# EAGLE schematic mic-preamp-stereo8x (EAGLE 6.2)
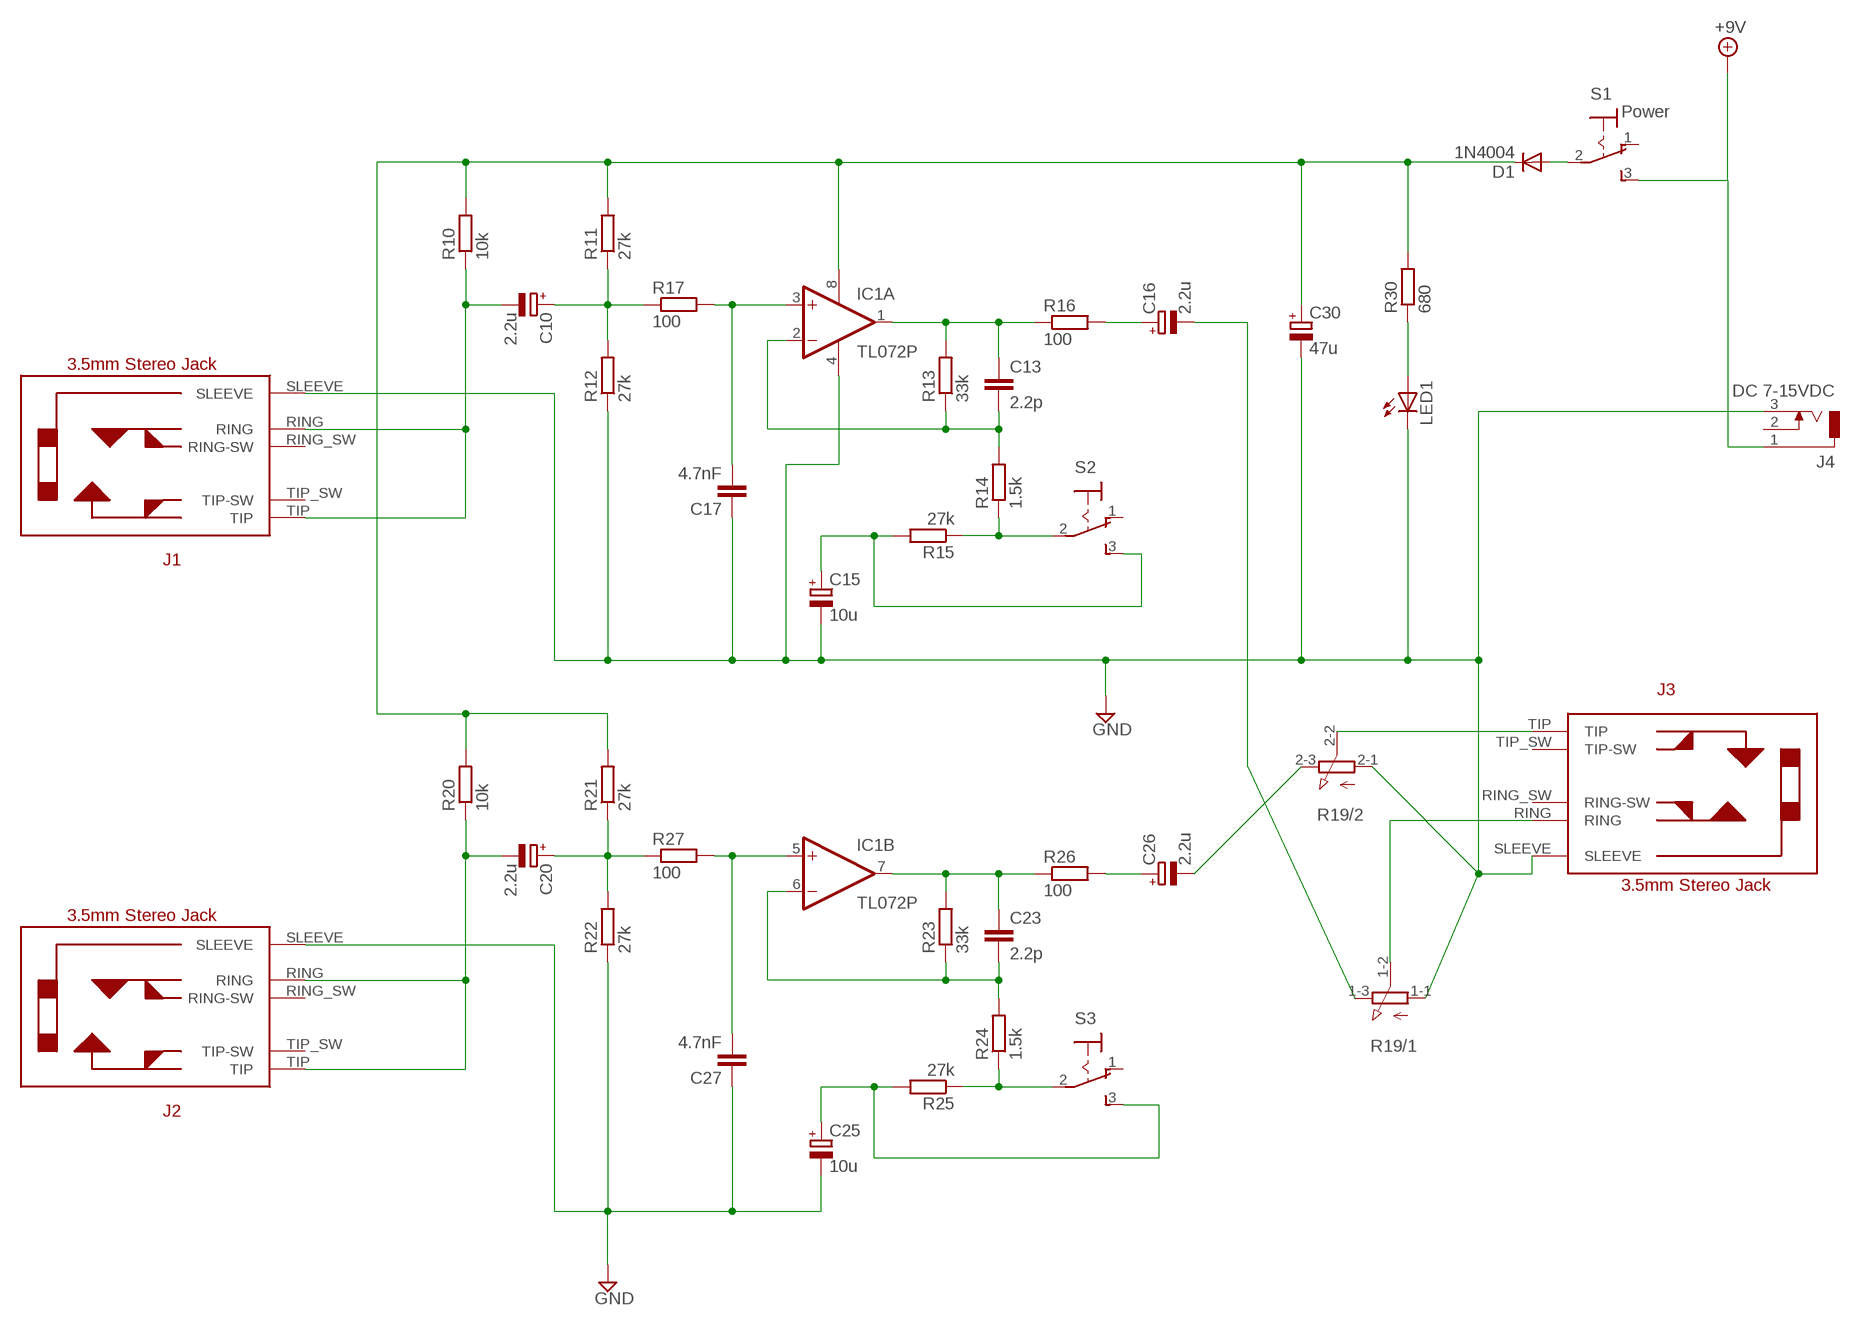
[diagram p0: schematic, sheet 1]

## Parts
C10  2.2u  CPOL-EUE2-5  [E2-5]
C13  2.2p  C-EU025-024X044  [C025-024X044]
C15  10u  CPOL-EUE2-5  [E2-5]
C16  2.2u  CPOL-EUE2-5  [E2-5]
C17  4.7nF  C-EU025-024X044  [C025-024X044]
C20  2.2u  CPOL-EUE2-5  [E2-5]
C23  2.2p  C-EU025-024X044  [C025-024X044]
C25  10u  CPOL-EUE2-5  [E2-5]
C26  2.2u  CPOL-EUE2-5  [E2-5]
C27  4.7nF  C-EU025-024X044  [C025-024X044]
C30  47u  CPOL-EUE2-5  [E2-5]
D1  1N4004  [DO41-10]
IC1  TL072P  [DIL08]
J1  PICAXE_STEREOJACKSOCKET  [PICAXE_STEREOJACKSOCKET]
J2  PICAXE_STEREOJACKSOCKET  [PICAXE_STEREOJACKSOCKET]
J3  Stereo Out  PICAXE_STEREOJACKSOCKET  [PICAXE_STEREOJACKSOCKET]
J4  DC 7-15VDC  DCJ0202  [DCJ0202]
LED1  LED5MM  [LED5MM]
R10  10k  R-EU_0207/5V  [0207/5V]
R11  27k  R-EU_0207/5V  [0207/5V]
R12  27k  R-EU_0207/5V  [0207/5V]
R13  33k  R-EU_0207/5V  [0207/5V]
R14  1.5k  R-EU_0207/5V  [0207/5V]
R15  27k  R-EU_0207/5V  [0207/5V]
R16  100  R-EU_0207/5V  [0207/5V]
R17  100  R-EU_0207/5V  [0207/5V]
R19  3RP/1610G  [3RP/1610G]
R20  10k  R-EU_0207/5V  [0207/5V]
R21  27k  R-EU_0207/5V  [0207/5V]
R22  27k  R-EU_0207/5V  [0207/5V]
R23  33k  R-EU_0207/5V  [0207/5V]
R24  1.5k  R-EU_0207/5V  [0207/5V]
R25  27k  R-EU_0207/5V  [0207/5V]
R26  100  R-EU_0207/5V  [0207/5V]
R27  100  R-EU_0207/5V  [0207/5V]
R30  680  R-EU_0207/5V  [0207/5V]
S1  Power  M9040P  [M9040P]
S2  M9040P  [M9040P]
S3  M9040P  [M9040P]

## Nets
+9V: J4.1 S1.3(S)
GND [Ground]: C15.- C17.1 C25.- C27.1 C30.- IC1.4(P:V-) J1.SLEEVE J2.SLEEVE J3.SLEEVE J4.3 LED1.K(C) R12.1 R19.1-1(/1:A) R19.2-1(/2:A) R22.1
N$1: C10.+ R11.1 R12.2 R17.1
N$2: C13.1 IC1.1(A:OUT) R13.2 R16.1
N$3: C13.2 IC1.2(A:-IN) R13.1 R14.2
N$4: C30.+ D1.C IC1.8(P:V+) R10.2 R11.2 R20.2 R21.2 R30.2
N$5: R14.1 R15.1 S2.2(P)
N$6: C16.+ R16.2
N$7: C10.- J1.RING J1.TIP R10.1
N$8: D1.A S1.2(P)
N$9: C15.+ R15.2 S2.3(S)
N$10: C16.- R19.1-3(/1:E)
N$11: LED1.A R30.1
N$12: C20.+ R21.1 R22.2 R27.1
N$13: C26.- R19.2-3(/2:E)
N$16: C23.1 IC1.7(B:OUT) R23.2 R26.1
N$17: C23.2 IC1.6(B:-IN) R23.1 R24.2
N$18: J3.TIP R19.2-2(/2:S)
N$19: R24.1 R25.1 S3.2(P)
N$20: C26.+ R26.2
N$21: C20.- J2.RING J2.TIP R20.1
N$22: C25.+ R25.2 S3.3(S)
N$23: J3.RING R19.1-2(/1:S)
N$24: C17.2 IC1.3(A:+IN) R17.2
N$27: C27.2 IC1.5(B:+IN) R27.2
Unconnected: J1.RING_SW(RING-SW) J1.TIP_SW(TIP-SW) J2.RING_SW(RING-SW) J2.TIP_SW(TIP-SW) J3.RING_SW(RING-SW) J3.TIP_SW(TIP-SW) J4.2 S1.1(O) S2.1(O) S3.1(O)

## Library data of the parts
C10 C15 C16 C20 C25 C26 C30 = rcl:CPOL-EU: POLARIZED CAPACITOR, European symbol
C13 C17 C23 C27 = rcl:C-EU: CAPACITOR, European symbol
D1 = diode:1N4004: DIODE general purpose rectifier, 1 A
IC1 = linear:TL072: OP AMP
J1-J3 = PICAXE_StereoJackSocket:PICAXE_STEREOJACKSOCKET
J4 = con-jack:DCJ0202: DC POWER JACK Source: DCJ0202.pdf; OC_FARNELL: unknown; OC_NEWARK: unknown
LED1 = led:LED: LED OSRAM: - CHIPLED LG R971, LG N971, LY N971, LG Q971, LY Q971, LO R971, LY R971 LH N974, LH R974 LS Q976, LO Q976, LY Q976 LO Q996 - Hyper CHIPLED LW Q18S LB Q993, LB Q99A, LB R99A - SideLED LS A670, LO A670, LY A670, LG A670, LP A670 LB A673, LV A673, LT A673, LW A673 LH A674 LY A675 LS A676, LA A676, LO A676, LY A676, LW A676 LS A679, LY A679, LG A679 - Hyper Micro SIDELED® LS Y876, LA Y876, LO Y876, LY Y876 LT Y87S - SmartLED LW L88C, LW L88S LB L89C, LB L89S, LG L890 LS L89K, LO L89K, LY L89K LS L896, LA L896, LO L896, LY L896 - TOPLED LS T670, LO T670, LY T670, LG T670, LP T670 LSG T670, LSP T670, LSY T670, LOP T670, LYG T670 LG T671, LOG T671, LSG T671 LB T673, LV T673, LT T673, LW T673 LH T674 LS T676, LA T676, LO T676, LY T676, LB T676, LH T676, LSB T676, LW T676 LB T67C, LV T67C, LT T67C, LS T67K, LO T67K, LY T67K, LW E67C LS E67B, LA E67B, LO E67B, LY E67B, LB E67C, LV E67C, LT E67C LW T67C LS T679, LY T679, LG T679 LS T770, LO T770, LY T770, LG T770, LP T770 LB T773, LV T773, LT T773, LW T773 LH T774 LS E675, LA E675, LY E675, LS T675 LS T776, LA T776, LO T776, LY T776, LB T776 LHGB T686 LT T68C, LB T68C - Hyper Mini TOPLED® LB M676 - Mini TOPLED Santana® LG M470 LS M47K, LO M47K, LY M47K Source: http://www.osram.convergy.de LUXEON: - LUMILED® LXK2-PW12-R00, LXK2-PW12-S00, LXK2-PW14-U00, LXK2-PW14-V00 LXK2-PM12-R00, LXK2-PM12-S00, LXK2-PM14-U00 LXK2-PE12-Q00, LXK2-PE12-R00, LXK2-PE12-S00, LXK2-PE14-T00, LXK2-PE14-U00 LXK2-PB12-K00, LXK2-PB12-L00, LXK2-PB12-M00, LXK2-PB14-N00, LXK2-PB14-P00, LXK2-PB14-Q00 LXK2-PR12-L00, LXK2-PR12-M00, LXK2-PR14-Q00, LXK2-PR14-R00 LXK2-PD12-Q00, LXK2-PD12-R00, LXK2-PD12-S00 LXK2-PH12-R00, LXK2-PH12-S00 LXK2-PL12-P00, LXK2-PL12-Q00, LXK2-PL12-R00 Source: www.luxeon.com KINGBRIGHT: KA-3528ASYC Source: www.kingbright.com
R10-R16 R20-R26 R30 = rcl:R-EU_: RESISTOR, European symbol
R17 R27 = resistor:R-EU_: RESISTOR, European symbol
R19 = pot:3RP/1610G: 16mm Potentiometer two level Source: http://www.alphapotentiometers.net/html/16mm_pot_2.html
S1-S3 = switch:M9040P: TOGGLE SWITCH Marquardt

## Net classes
0 default: width 0.381 mm
1 Ground: width 0.305 mm, clearance 0.229 mm